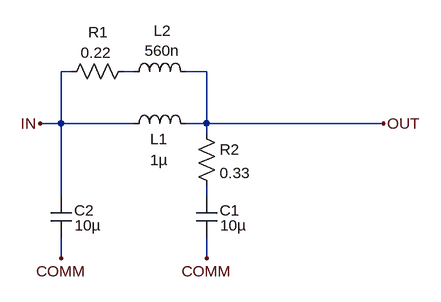
[diagram p0: schematic boost-converter_input-filter.asc]
boost-converter_input-filter.asc, the LTspice schematic file:
Version 4
SHEET 1 880 680
WIRE -16 48 -32 48
WIRE 80 48 64 48
WIRE 192 48 160 48
WIRE -32 128 -32 48
WIRE -32 128 -64 128
WIRE 80 128 -32 128
WIRE 192 128 192 48
WIRE 192 128 160 128
WIRE 464 128 192 128
WIRE 192 144 192 128
WIRE -32 240 -32 128
WIRE 192 240 192 224
WIRE -32 336 -32 304
WIRE 192 336 192 304
FLAG -64 128 IN
FLAG 464 128 OUT
FLAG 192 336 COMM
FLAG -32 336 COMM
SYMBOL cap 176 240 R0
WINDOW 0 36 22 Left 2
WINDOW 3 37 45 Left 2
SYMATTR InstName C1
SYMATTR Value 10µ
SYMATTR SpiceLine V=25 Irms=0 Rser=50m Lser=3n
SYMBOL ind 64 144 R270
WINDOW 0 -24 55 VTop 2
WINDOW 3 -25 55 VBottom 2
SYMATTR InstName L1
SYMATTR Value 1µ
SYMATTR SpiceLine Rser=50m
SYMBOL ind 64 64 R270
WINDOW 0 63 60 VTop 2
WINDOW 3 64 60 VBottom 2
SYMATTR InstName L2
SYMATTR Value 560n
SYMATTR SpiceLine Rser=20m
SYMBOL res -32 64 R270
WINDOW 0 61 57 VTop 2
WINDOW 3 61 54 VBottom 2
SYMATTR InstName R1
SYMATTR Value 0.22
SYMBOL res 176 128 R0
SYMATTR InstName R2
SYMATTR Value 0.33
SYMBOL cap -48 240 R0
WINDOW 0 36 22 Left 2
WINDOW 3 37 45 Left 2
SYMATTR InstName C2
SYMATTR Value 10µ
SYMATTR SpiceLine V=25 Irms=0 Rser=50m Lser=3n

The netlist it stands for:
* boost-converter_input-filter.asc
C1 N002 COMM 10µ V=25 Irms=0 Rser=50m Lser=3n
L1 IN OUT 1µ Rser=50m
L2 N001 OUT 560n Rser=20m
R1 IN N001 0.22
R2 OUT N002 0.33
C2 IN COMM 10µ V=25 Irms=0 Rser=50m Lser=3n
.backanno
.end